# Altium schematic sheet Sheet1.SchDoc
size A4; SheetNumber: 1; SheetTotal: 1
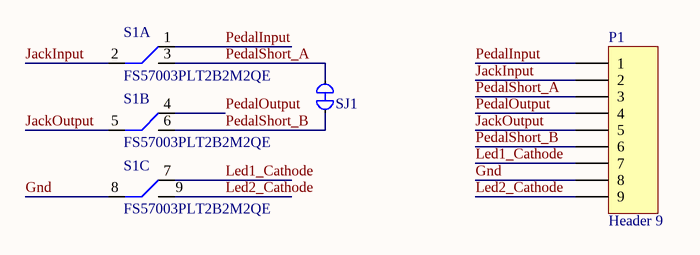
[diagram p0: Sheet1.SchDoc]

## Parts
P1  Header 9  [HDR1X9_2.54]
S1  FS57003PLT2B2M2QE  [SW_FS57003PLT2B2M2QE]  (parts A,B,C of 3)
SJ1  Solder Jumper Shorted  [SOLDER_JUMPER_SHORTED]  (value not drawn)  (net tie, no BOM)

## Nets
Gnd: P1.8 S1.8
JackInput: P1.2 S1.2
JackOutput: P1.5 S1.5
Led1_Cathode: P1.7 S1.7
Led2_Cathode: P1.9 S1.9
PedalInput: P1.1 S1.1
PedalOutput: P1.4 S1.4
PedalShort_A: P1.3 S1.3 SJ1.2
PedalShort_B: P1.6 S1.6 SJ1.1

## Library data of the parts
P1 = Header 9: Header, 9-Pin; LatestRevisionDate: 17-Jul-2002; LatestRevisionNote: Re-released for DXP Platform.; Publisher: Altium Limited
S1 = FS57003PLT2B2M2QE: Mechanical 3PDT Footswitch